# EAGLE schematic rotaryDisplay_doc (EAGLE 9.7.0)
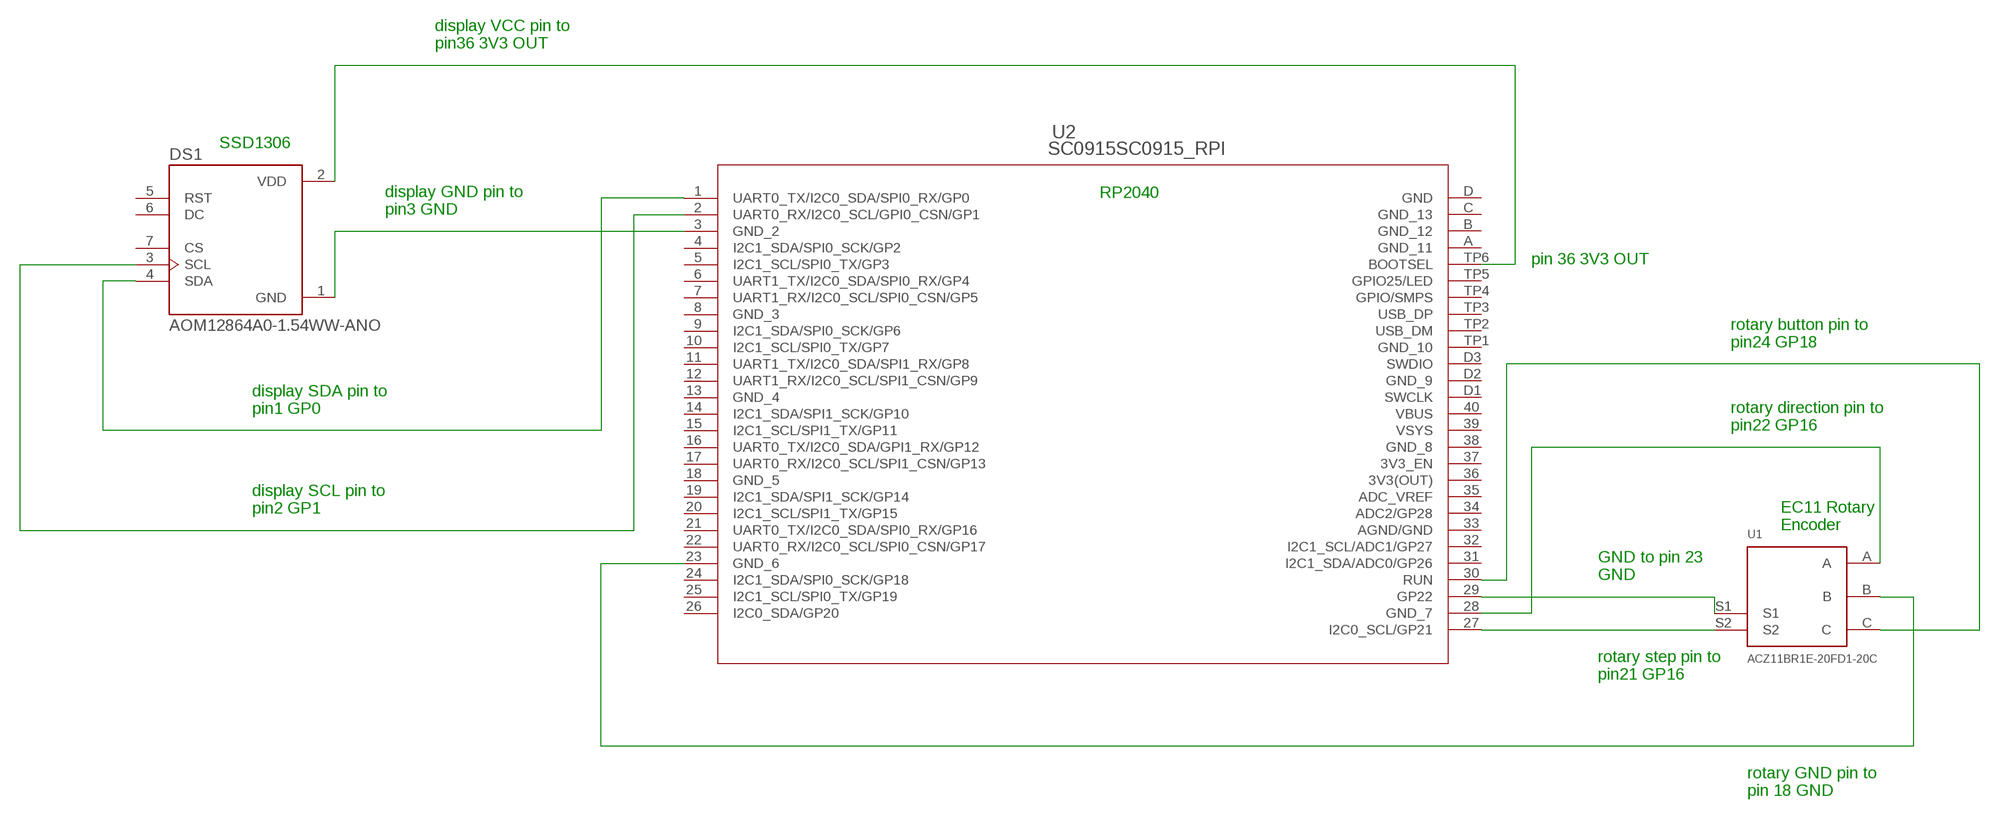
[diagram p0: schematic, sheet 1]

## Parts
DS1  AOM12864A0-1.54WW-ANO  [LCD_AOM12864A0-1.54WW-ANO]
U1  ACZ11BR1E-20FD1-20C  [CUI_ACZ11BR1E-20FD1-20C]
U2  SC0915SC0915_RPI  [SC0915_RPI]

## Nets
N$1: DS1.3(SCL) U2.2(UART0_RX/I2C0_SCL/GPI0_CSN/GP1)
N$2: DS1.1(GND) U2.3(GND_2)
N$3: DS1.4(SDA) U2.1(UART0_TX/I2C0_SDA/SPI0_RX/GP0)
N$4: DS1.2(VDD) U2.TP6(BOOTSEL)
N$5: U1.S2 U2.27(I2C0_SCL/GP21)
N$6: U1.S1 U2.29(GP22)
N$7: U1.A U2.28(GND_7)
N$8: U1.B U2.23(GND_6)
N$9: U1.C
Unconnected: DS1.5(RST) DS1.6(DC) DS1.7(CS) U2.4(I2C1_SDA/SPI0_SCK/GP2) U2.5(I2C1_SCL/SPI0_TX/GP3) U2.6(UART1_TX/I2C0_SDA/SPI0_RX/GP4) U2.7(UART1_RX/I2C0_SCL/SPI0_CSN/GP5) U2.8(GND_3) U2.9(I2C1_SDA/SPI0_SCK/GP6) U2.10(I2C1_SCL/SPI0_TX/GP7) U2.11(UART1_TX/I2C0_SDA/SPI1_RX/GP8) U2.12(UART1_RX/I2C0_SCL/SPI1_CSN/GP9) U2.13(GND_4) U2.14(I2C1_SDA/SPI1_SCK/GP10) U2.15(I2C1_SCL/SPI1_TX/GP11) U2.16(UART0_TX/I2C0_SDA/GPI1_RX/GP12) U2.17(UART0_RX/I2C0_SCL/SPI1_CSN/GP13) U2.18(GND_5) U2.19(I2C1_SDA/SPI1_SCK/GP14) U2.20(I2C1_SCL/SPI1_TX/GP15) U2.21(UART0_TX/I2C0_SDA/SPI0_RX/GP16) U2.22(UART0_RX/I2C0_SCL/SPI0_CSN/GP17) U2.24(I2C1_SDA/SPI0_SCK/GP18) U2.25(I2C1_SCL/SPI0_TX/GP19) U2.26(I2C0_SDA/GP20) U2.30(RUN) U2.31(I2C1_SDA/ADC0/GP26) U2.32(I2C1_SCL/ADC1/GP27) U2.33(AGND/GND) U2.34(ADC2/GP28) U2.36(3V3(OUT)) U2.38(GND_8) U2.A(GND_11) U2.B(GND_12) U2.C(GND_13) U2.D1(SWCLK) U2.D2(GND_9) U2.D3(SWDIO) U2.D(GND) U2.TP1(GND_10) U2.TP2(USB_DM) U2.TP3(USB_DP) U2.TP4(GPIO/SMPS) U2.TP5(GPIO25/LED)

## Notes on the sheet
- display VCC pin to 
  pin36 3V3 OUT
- SSD1306
- RP2040
- display GND pin to 
  pin3 GND
- pin 36 3V3 OUT
- rotary button pin to 
  pin24 GP18
- display SDA pin to 
  pin1 GP0
- rotary direction pin to 
  pin22 GP16
- display SCL pin to 
  pin2 GP1
- EC11 Rotary 
  Encoder
- GND to pin 23 
  GND
- rotary step pin to
  pin21 GP16
- rotary GND pin to 
  pin 18 GND

## Power pins joined to a net without a drawn wire
3V3_EN: U2.37(3V3_EN)
ADC_VREF: U2.35(ADC_VREF)
VBUS: U2.40(VBUS)
VSYS: U2.39(VSYS)

## Library data of the parts
DS1 = AOM12864A0-1.54WW-ANO:AOM12864A0-1.54WW-ANO: Non-Touch Graphic LCD Display Module - White OLED SPI 1.54in (39.12mm) 128 x 64; MANUFACTURER: Orient Display; MAXIMUM_PACKAGE_HEIGHT: 5.5mm; PARTREV: O; STANDARD: Manufacturer Recommendations
U1 = ACZ11BR1E-20FD1-20C:ACZ11BR1E-20FD1-20C: 11 mm, 12 ~ 20 PPR, Through Hole, Mechanical Panel Mount Encoder; MANUFACTURER: CUI Devices; MAXIMUM_PACKAGE_HEIGHT: 26.5mm; PARTREV: 1.02; STANDARD: Manufacturer Recommendations
U2 = 2023-02-16_19-39-48_Library:SC0915; COPYRIGHT: Copyright (C) 2023 Ultra Librarian. All rights reserved.; MANUFACTURER_PART_NUMBER: SC0915; MFR_NAME: Raspberry Pi